# EAGLE design Vertex_V1 (EAGLE 7.7.0)
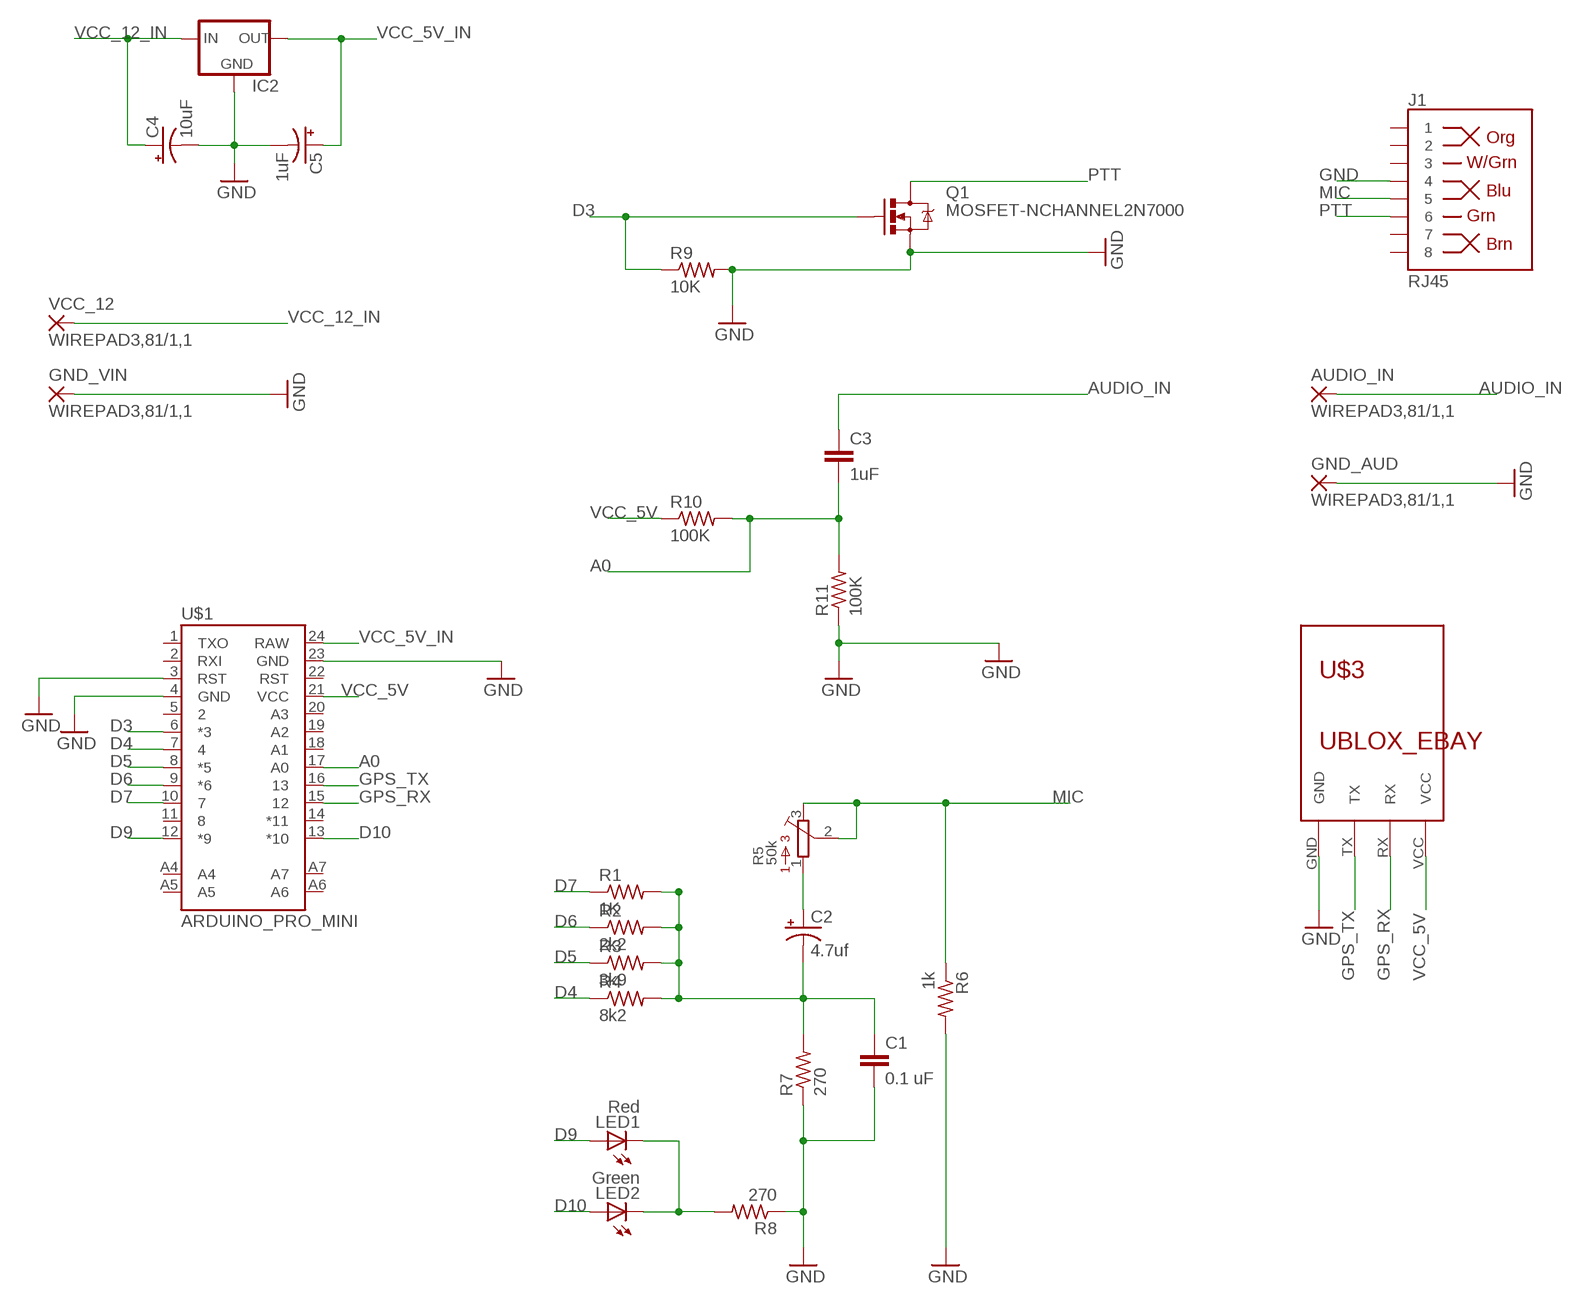
[diagram p0: schematic, sheet 1]

## Parts
AUDIO_IN  WIREPAD3,81/1,1  [3,81/1,1]
C1  0.1 uF  0.1UF-50V-20%(PTH)KIT-EZ  [CAP-PTH-SMALL-KIT]
C2  4.7uf  CAP_POLPTH2  [CPOL-RADIAL-10UF-25V]
C3  1uF  0.1UF-50V-20%(PTH)KIT-EZ  [CAP-PTH-SMALL-KIT]
C4  10uF  CAP_POLPTH2  [CPOL-RADIAL-10UF-25V]
C5  1uF  CAP_POLPTH2  [CPOL-RADIAL-10UF-25V]
GND_AUD  WIREPAD3,81/1,1  [3,81/1,1]
GND_VIN  WIREPAD3,81/1,1  [3,81/1,1]
IC2  78XXS  [78XXS]
J1  RJ45  RJ45-8PTH  [RJ45-8]
LED1  Red  LED5MM  [LED5MM]
LED2  Green  LED5MM  [LED5MM]
Q1  MOSFET-NCHANNEL2N7000  [TO-92]
R1  1K  R-US_0309/V  [0309V]
R2  2k2  R-US_0309/V  [0309V]
R3  3k9  R-US_0309/V  [0309V]
R4  8k2  R-US_0309/V  [0309V]
R5  50k  3362P  [3362P]
R6  1k  R-US_0309/V  [0309V]
R7  270  R-US_0309/V  [0309V]
R8  270  R-US_0309/V  [0309V]
R9  10K  R-US_0309/V  [0309V]
R10  100K  R-US_0309/V  [0309V]
R11  100K  R-US_0309/V  [0309V]
U$1  ARDUINO_PRO_MINI  [ARDUINO_PRO_MINI]
U$3  UBLOX_EBAY  [UBLOX_EBAY]
VCC_12  WIREPAD3,81/1,1  [3,81/1,1]

## Nets
A0: C3.2 R10.2 R11.2 U$1.17(A0)
AUDIO_IN: AUDIO_IN.1(P) C3.1
D3: Q1.2(G) R9.1 U$1.6(*3)
D4: R4.1 U$1.7
D5: R3.1 U$1.8(*5)
D6: R2.1 U$1.9(*6)
D7: R1.1 U$1.10
D9: LED1.A U$1.12(*9)
D10: LED2.A U$1.13(*10)
GND: C1.2 C4.2(-) C5.2(-) GND_AUD.1(P) GND_VIN.1(P) IC2.GND J1.4 Q1.1(S) R6.2 R7.1 R8.1 R9.2 R11.1 U$1.3(RST) U$1.4(GND) U$1.23(GND) U$3.GND
GPS_RX: U$1.15 U$3.RX
GPS_TX: U$1.16 U$3.TX
MIC: J1.5 R5.2 R5.3 R6.1
N$5: C1.1 C2.2(-) R1.2 R2.2 R3.2 R4.2 R7.2
N$6: C2.1(+) R5.1
N$9: LED1.K(C) LED2.K(C) R8.2
PTT: J1.6 Q1.3(D)
VCC_5V: R10.1 U$1.21(VCC) U$3.VCC
VCC_5V_IN: C5.1(+) IC2.OUT U$1.24(RAW)
VCC_12_IN: C4.1(+) IC2.IN VCC_12.1(P)
Unconnected: J1.1 J1.2 J1.3 J1.7 J1.8 U$1.1(TXO) U$1.2(RXI) U$1.5 U$1.11 U$1.14(*11) U$1.18(A1) U$1.19(A2) U$1.20(A3) U$1.22(RST) U$1.A4 U$1.A5 U$1.A6 U$1.A7

## Library data of the parts
AUDIO_IN GND_AUD GND_VIN VCC_12 = wirepad:WIREPAD: Wire PAD connect wire on PCB
C1 C3 = SparkFun-Capacitors:0.1UF-50V-20%(PTH): CAP-08370; PROD_ID: CAP-08370
C2 C4 C5 = SparkFun-Passives:CAP_POL: Capacitor Polarized These are standard SMD and PTH capacitors. Normally 10uF, 47uF, and 100uF in electrolytic and tantalum varieties. Always verify the external diameter of the through hole cap, it varies with capacity, voltage, and manufacturer. The EIA devices should be standard.
IC2 = v-reg:78XXS: VOLTAGE REGULATOR
J1 = SparkFun-Connectors:RJ45-8: RJ45 Jack Simple RJ45, 8-pin connection - connector for common Cat5, Cat5e, and Cat6 Ethernet cables. Footprint not yet proven in production. Connector sku is PRT-00643; Breakout PCB sku is BOB-00716.; PROD_ID: CONN-08506
LED1 LED2 = led:LED: LED OSRAM: - CHIPLED LG R971, LG N971, LY N971, LG Q971, LY Q971, LO R971, LY R971 LH N974, LH R974 LS Q976, LO Q976, LY Q976 LO Q996 - Hyper CHIPLED LW Q18S LB Q993, LB Q99A, LB R99A - SideLED LS A670, LO A670, LY A670, LG A670, LP A670 LB A673, LV A673, LT A673, LW A673 LH A674 LY A675 LS A676, LA A676, LO A676, LY A676, LW A676 LS A679, LY A679, LG A679 - Hyper Micro SIDELED® LS Y876, LA Y876, LO Y876, LY Y876 LT Y87S - SmartLED LW L88C, LW L88S LB L89C, LB L89S, LG L890 LS L89K, LO L89K, LY L89K LS L896, LA L896, LO L896, LY L896 - TOPLED LS T670, LO T670, LY T670, LG T670, LP T670 LSG T670, LSP T670, LSY T670, LOP T670, LYG T670 LG T671, LOG T671, LSG T671 LB T673, LV T673, LT T673, LW T673 LH T674 LS T676, LA T676, LO T676, LY T676, LB T676, LH T676, LSB T676, LW T676 LB T67C, LV T67C, LT T67C, LS T67K, LO T67K, LY T67K, LW E67C LS E67B, LA E67B, LO E67B, LY E67B, LB E67C, LV E67C, LT E67C LW T67C LS T679, LY T679, LG T679 LS T770, LO T770, LY T770, LG T770, LP T770 LB T773, LV T773, LT T773, LW T773 LH T774 LS E675, LA E675, LY E675, LS T675 LS T776, LA T776, LO T776, LY T776, LB T776 LHGB T686 LT T68C, LB T68C - Hyper Mini TOPLED® LB M676 - Mini TOPLED Santana® LG M470 LS M47K, LO M47K, LY M47K Source: http://www.osram.convergy.de LUXEON: - LUMILED® LXK2-PW12-R00, LXK2-PW12-S00, LXK2-PW14-U00, LXK2-PW14-V00 LXK2-PM12-R00, LXK2-PM12-S00, LXK2-PM14-U00 LXK2-PE12-Q00, LXK2-PE12-R00, LXK2-PE12-S00, LXK2-PE14-T00, LXK2-PE14-U00 LXK2-PB12-K00, LXK2-PB12-L00, LXK2-PB12-M00, LXK2-PB14-N00, LXK2-PB14-P00, LXK2-PB14-Q00 LXK2-PR12-L00, LXK2-PR12-M00, LXK2-PR14-Q00, LXK2-PR14-R00 LXK2-PD12-Q00, LXK2-PD12-R00, LXK2-PD12-S00 LXK2-PH12-R00, LXK2-PH12-S00 LXK2-PL12-P00, LXK2-PL12-Q00, LXK2-PL12-R00 Source: www.luxeon.com KINGBRIGHT: KA-3528ASYC Source: www.kingbright.com
Q1 = SparkFun-DiscreteSemi:MOSFET-NCHANNEL: Common NMOSFET Parts MFG P/N Store ID Prod ID FDD8780 TRANS-09984 SI7820DN TRANS-11055 FDS6630A IC-08089 2N7002PW TRANS-11151 FQP30N06L COM-10213 TRANS-10060 BSS123LT1G TRANS-08345 BSS138 TRANS-00830 BS170 2N7000
R1-R4 R6-R11 = resistor:R-US_: RESISTOR, American symbol
R5 = bourns:3362: 3362 Series 1/4" Square Trimmer
U$1 = SparkFun-Boards:ARDUINO_PRO_MINI
U$3 = Ublox-Ebay:UBLOX_EBAY

## Board
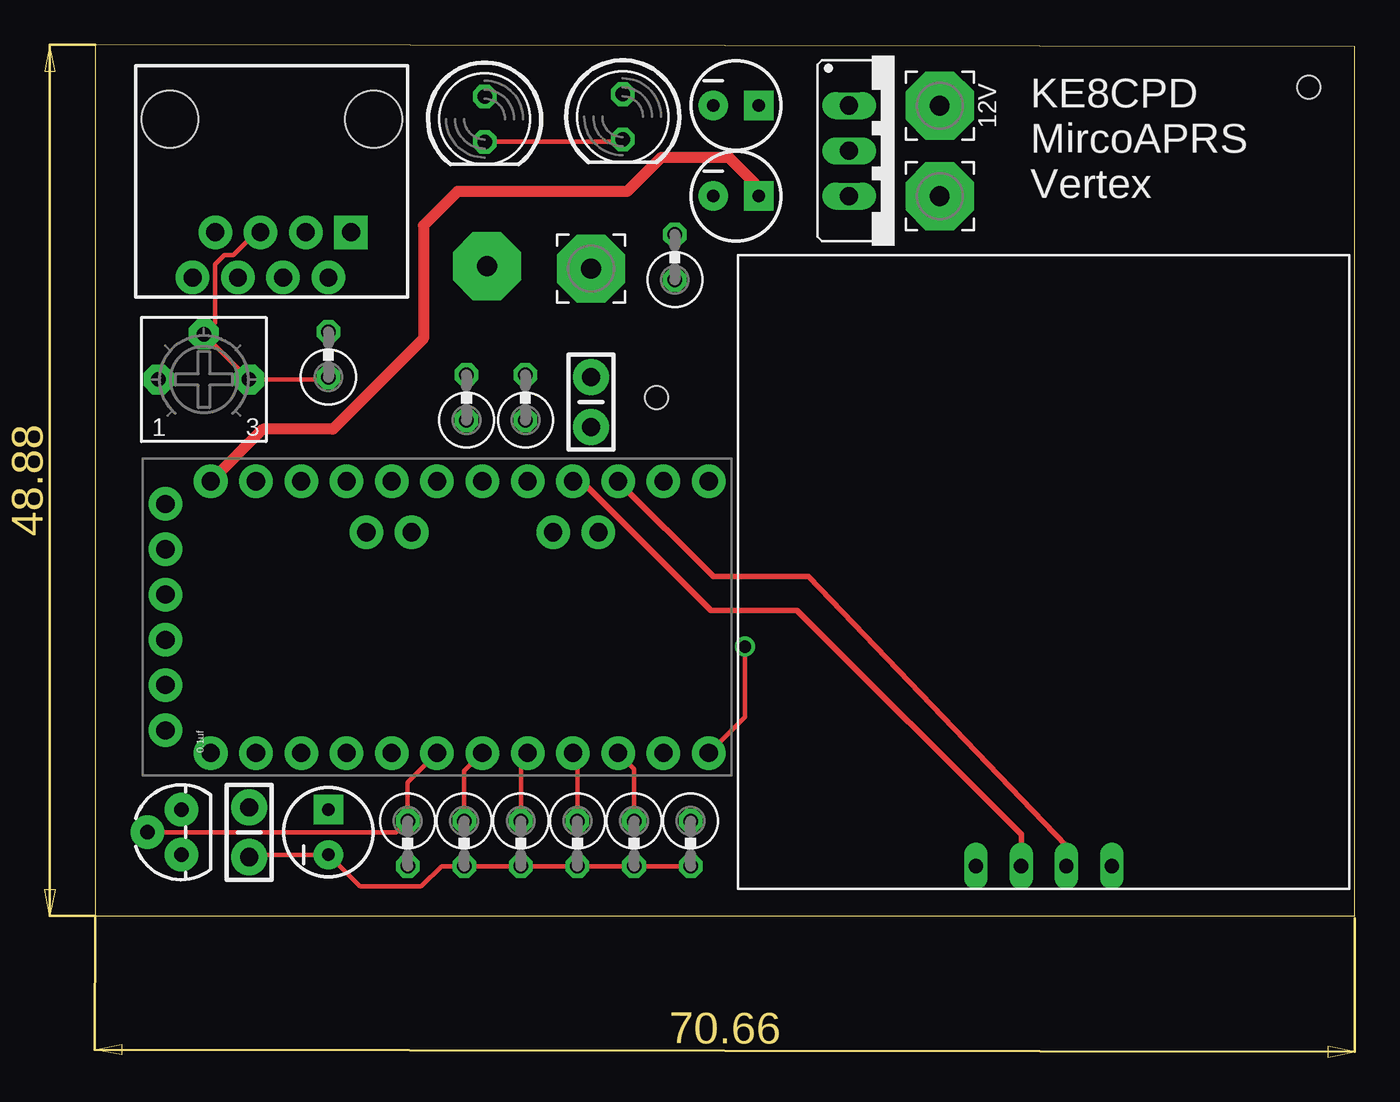
[diagram p1: board, top side]
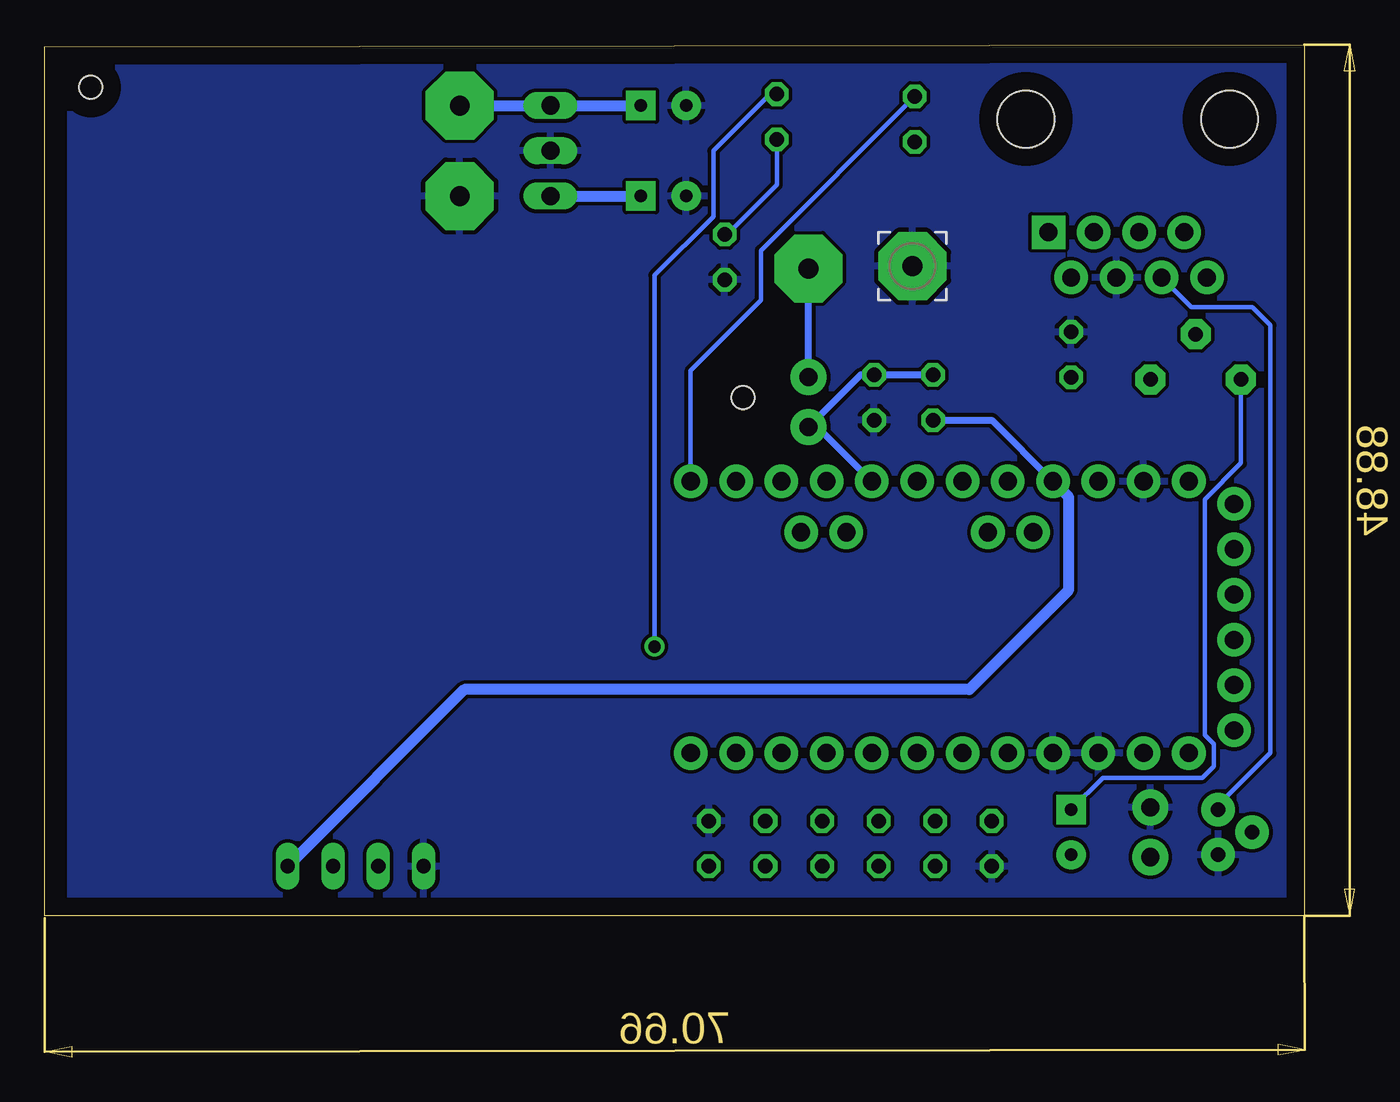
[diagram p2: board, bottom side, seen from below]

Size 70.66 x 48.88 mm. Coordinates in mm from the lower left corner, seen from the top.
Outline: 0,0 70.66,0 70.66,48.76 0,48.88 0,0
Copper layers (1*16): Top 0.035mm / dielectric 1.5mm / Bottom 0.035mm
Design rules "default": minimum track width 10mil, minimum drill 24mil, track to track 8mil, track to pad 8mil, pad to pad 8mil, via to via 8mil, smd to smd 8mil, copper to edge 40mil, drill to drill 8mil, minimum pad ring 10mil, minimum via ring 8mil, stop-mask expansion 4mil, vias tented up to drill 0mil, thermal gap 10mil
Holes 1.3 mm at 68.07,46.48 31.5,29.08

### Footprints (pad centres in the part's own frame; a part is rotated, then mirrored left to right if it is on the bottom)
3,81/1,1 = drill 1.118 pad 3.81 octagon: 1 0,0
CAP-PTH-SMALL-KIT = drill 1.016 pad 2.032: 1 -1.397,0; 2 1.397,0
CPOL-RADIAL-10UF-25V = drill 0.7 pad 1.651 square: 1 1.27,0 | drill 0.7 pad 1.651: 2 -1.27,0
78XXS = drill 1.016 long: GND 0,-2.54; IN -2.54,-2.54; OUT 2.54,-2.54
RJ45-8 = drill 1 pad 1.88 square: 1 -4.445,6.35 | drill 1 pad 1.88: 2 -3.175,8.89; 3 -1.905,6.35; 4 -0.635,8.89; 5 0.635,6.35; 6 1.905,8.89; 7 3.175,6.35; 8 4.445,8.89 | hole 3.2: -5.715,0; 5.715,0
LED5MM = drill 0.813 octagon: A -1.27,0; K 1.27,0
TO-92 = drill 0.813 pad 1.88: 1 -1.27,0; 2 0,1.905; 3 1.27,0
0309V = drill 0.813 octagon: 1 -1.27,0; 2 1.27,0
3362P = drill 0.813 pad 1.676 octagon: 1 -2.54,0; 2 0,2.54; 3 2.54,0
ARDUINO_PRO_MINI = drill 1.016 pad 1.88: 1 -7.62,12.7; 2 -7.62,10.16; 3 -7.62,7.62; 4 -7.62,5.08; 5 -7.62,2.54; 6 -7.62,0; 7 -7.62,-2.54; 8 -7.62,-5.08; 9 -7.62,-7.62; 10 -7.62,-10.16; 11 -7.62,-12.7; 12 -7.62,-15.24; 13 7.62,-15.24; 14 7.62,-12.7; 15 7.62,-10.16; 16 7.62,-7.62; 17 7.62,-5.08; 18 7.62,-2.54; 19 7.62,0; 20 7.62,2.54; 21 7.62,5.08; 22 7.62,7.62; 23 7.62,10.16; 24 7.62,12.7; A4 4.763,1.429; A5 4.763,3.969; A6 4.763,-9.049; A7 4.763,-6.509; BLK -6.35,15.24; GND -3.81,15.24; GRN 6.35,15.24; RXI 1.27,15.24; TXO 3.81,15.24; VCC -1.27,15.24
UBLOX_EBAY = drill 0.8 long: GND 13.335,1.27; RX 18.415,1.27; TX 15.875,1.27; VCC 20.955,1.27

### Placement (x,y rotation side)
AUDIO_IN  27.81,36.32 0 top
C1  8.64,4.7 90 top
C2  13.08,4.7 90 top
C3  27.81,28.83 270 top
C4  35.94,45.47 0 top
C5  35.94,40.39 0 top
GND_AUD  21.97,36.45 0 bottom
GND_VIN  47.37,40.39 90 top
IC2  44.83,42.93 270 top
J1  9.91,44.7 180 top
LED1  29.59,44.83 270 top
LED2  21.84,44.7 270 top
Q1  4.83,4.7 90 top
R1  30.23,4.06 270 top
R2  27.05,4.06 270 top
R3  23.88,4.06 270 top
R4  20.7,4.06 270 top
R5  6.1,30.1 0 top
R6  13.08,31.5 90 top
R7  33.4,4.06 270 top
R8  32.51,36.96 90 top
R9  17.53,4.06 270 top
R10  20.83,29.08 90 top
R11  24.13,29.08 90 top
U$1  19.18,16.76 90 top
U$3  36.07,1.52 0 top
VCC_12  47.37,45.47 90 top

### Tracks (layer width: path | path; a pad name or v marks a point on that pad's centre or on a via)
A0
  Bottom 0.406: R10.2 R11.2 24.89,30.35 C3.2 27.3,27.43 U$1.17
AUDIO_IN
  Bottom 0.406: C3.1 AUDIO_IN.1
D3
  Top 0.254: Q1.2 16.89,4.7 R9.1 17.53,7.49 U$1.6
D4
  Top 0.254: R4.1 20.7,8.13 U$1.7
D5
  Top 0.254: R3.1 23.88,8.76 U$1.8
D6
  Top 0.254: R2.1 27.05,8.89 U$1.9
D7
  Top 0.254: R1.1 30.23,8.26 U$1.10
D9  (via drill 0.7)
  Top 0.254: v36.45,15.11 36.45,11.18 U$1.12
  Bottom 0.254: LED1.A 29.97,46.1 33.15,42.93 33.15,39.24 36.45,35.94 v36.45,15.11
D10
  Bottom 0.254: U$1.13 34.42,30.61 30.48,34.54 30.48,37.34 LED2.A
GND
  pour Bottom: -0.64,53.34 69.22,52.7 69.22,-1.27 -1.27,-1.27
GPS_RX
  Top 0.305: U$3.RX 54.48,3.94 40.01,19.05 34.67,19.05 U$1.15
GPS_TX
  Top 0.305: U$3.TX 51.94,4.57 39.37,17.14 34.54,17.14 27.3,24.38 U$1.16
MIC
  Top 0.254: J1.5 9.02,38.35 7.75,37.08 7.24,37.08 6.73,36.58 6.73,33.27 R5.2 R5.3 12.95,30.1 R6.1
N$5
  Top 0.254: R7.2 R1.2 R2.2 R3.2 R4.2 19.43,2.79 18.29,1.65 14.86,1.65 C2.2 8.76,3.43 C1.1
N$6
  Bottom 0.254: C2.1 11.3,7.75 5.71,7.75 5.08,8.38 5.08,9.65 5.59,10.16 5.59,23.37 3.56,25.4 R5.1
N$9
  Top 0.254: LED2.K 29.46,43.43 LED1.K
  Bottom 0.254: R8.2 32.38,38.23 29.59,41.02 LED1.K
PTT
  Bottom 0.254: Q1.3 4.83,6.22 1.91,9.14 1.91,33.15 2.92,34.16 6.35,34.16 J1.6
VCC_5V
  Bottom 0.406: R10.1 17.53,27.81 U$1.21
  Bottom 0.61: U$3.VCC 47.12,12.7 18.8,12.7 13.21,18.29 13.21,23.5 U$1.21
VCC_5V_IN
  Top 0.61: C5.1 37.21,40.89 35.56,42.55 31.75,42.55 29.84,40.64 20.32,40.64 18.41,38.73 18.41,32.38 13.34,27.3 9.4,27.3 U$1.24
  Bottom 0.61: IC2.OUT C5.1
VCC_12_IN
  Bottom 0.61: VCC_12.1 IC2.IN C4.1

### Text on the board
tNames: KE8CPD | 12V | MircoAPRS | Vertex | 0.1uf